# Altium schematic sheet Sheet1.SchDoc
size A2
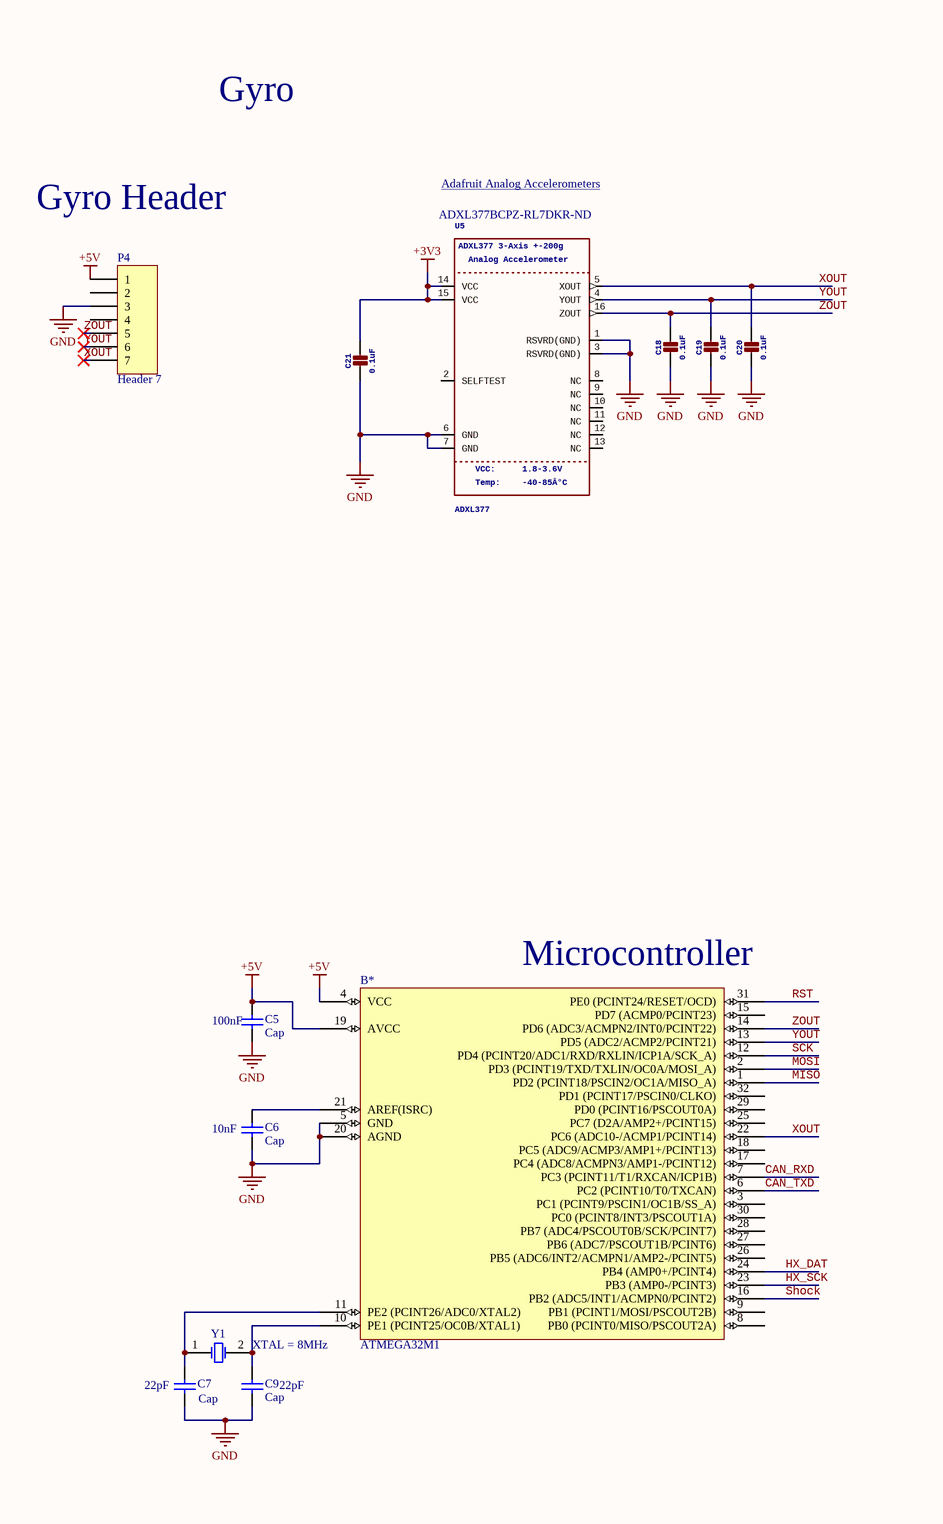
[diagram p0: Sheet1.SchDoc, left]
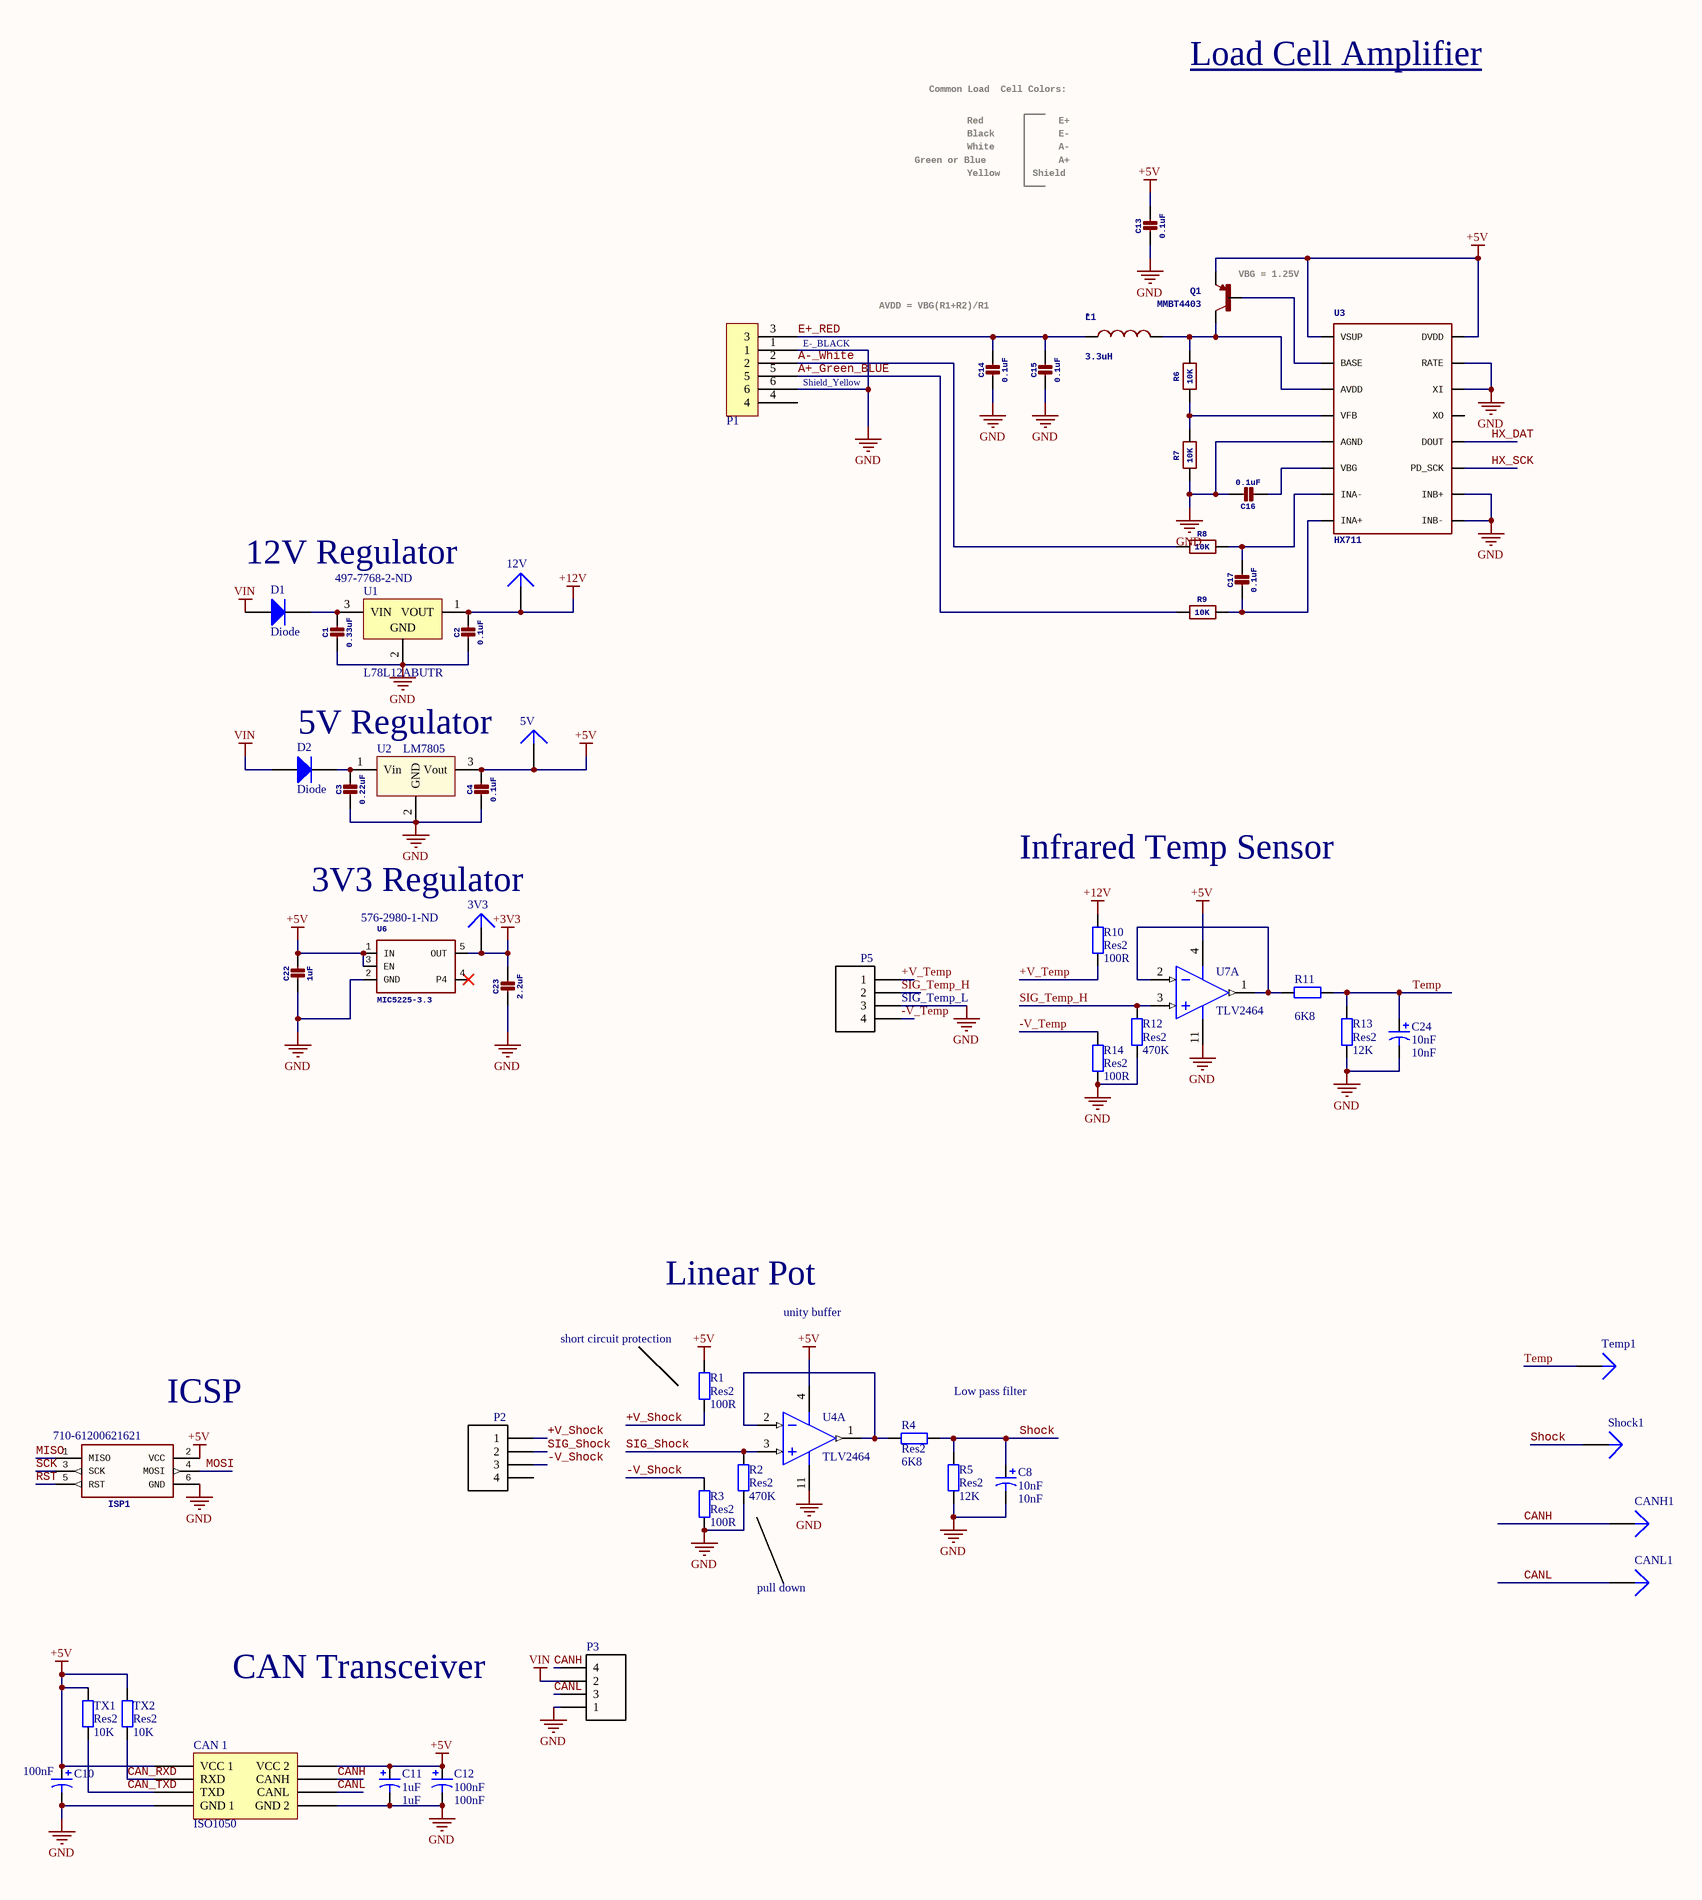
[diagram p1: Sheet1.SchDoc, right]

## Parts
3V3  TP  [SMD_TP]  (value not drawn)  (no BOM)
5V  TP  [SMD_TP]  (value not drawn)  (no BOM)
12V  TP  [SMD_TP]  (value not drawn)  (no BOM)
B*  ATMEGA32M1  [QFP80P900X900X120-32N]
C1  0.33uF  [6-0805_M]
C2  0.1uF  [6-0805_M]
C3  0.22uF  [6-0805_M]
C4  0.1uF  [6-0805_M]
C5  Cap  value 100nF  [CAP-0805]
C6  Cap  value 10nF  [CAP-0805]
C7  Cap  value 22pF  [CAP-0805]
C8  10nF  [6-0805_M]
C9  Cap  value 22pF  [CAP-0805]
C10  100nF  [6-0805_M]
C11  1uF  [6-0805_M]
C12  100nF  [6-0805_M]
C13  0.1uF  [6-0805_M]
C14  0.1uF  [6-0805_M]
C15  0.1uF  [6-0805_M]
C16  0.1uF  [6-0805_M]
C17  0.1uF  [6-0805_M]
C18  0.1uF  [0805_10MGAP]
C19  0.1uF  [0805_10MGAP]
C20  0.1uF  [0805_10MGAP]
C21  0.1uF  [0805_10MGAP]
C22  1uF  [6-0805_M]
C23  2.2uF  [6-0805_M]
C24  10nF  [6-0805_M]
CAN_1  ISO1050  [ISO1050]
CANH1  TP  [SMD_TP]  (value not drawn)  (no BOM)
CANL1  TP  [SMD_TP]  (value not drawn)  (no BOM)
D1  Diode  [6-0805_M]
D2  Diode  [6-0805_M]
ISP1  Supplier Part Number 1: 710-61200621621  [HDR2X3]  (hidden comment: AVRISP-BOX)
L1  3.3uH  [6-0805_M]
P1  S06B-PASK-2  [JST_S06B-PASK-2]  (value not drawn)
P2  S04B-PASK-2(LF)(SN)  [JST_S04B-PASK-2(LF)(SN)]  (value not drawn)
P3  S04B-PASK-2(LF)(SN)  [JST_S04B-PASK-2(LF)(SN)]  (value not drawn)
P4  Header 7  [HDR1X7]
P5  S04B-PASK-2(LF)(SN)  [JST_S04B-PASK-2(LF)(SN)]  (value not drawn)
Q1  MMBT4403  [SOT23-3]
R1  Res2  value 100R  [6-0805_M]
R2  Res2  value 470K  [6-0805_M]
R3  Res2  value 100R  [6-0805_M]
R4  Res2  value 6K8  [6-0805_M]
R5  Res2  value 12K  [6-0805_M]
R6  10K  [6-0805_M]
R7  10K  [6-0805_M]
R8  10K  [6-0805_M]
R9  10K  [6-0805_M]
R10  Res2  value 100R  [6-0805_M]
R11  value 6K8  [6-0805_M]
R12  Res2  value 470K  [6-0805_M]
R13  Res2  value 12K  [6-0805_M]
R14  Res2  value 100R  [6-0805_M]
Shock1  TP  [SMD_TP]  (value not drawn)  (no BOM)
Temp1  TP  [SMD_TP]  (value not drawn)  (no BOM)
TX1  Res2  value 10K  [6-0805_M]
TX2  Res2  value 10K  [6-0805_M]
U1  L78L12ABUTR  Supplier Part Number 1: 497-7768-2-ND  [SOT-89_M]
U2  LM7805  [SOT-223-2]
U3  HX711  [SO16]
U4  TLV2464  [SO14]  (part A of 4)
U5  ADXL377  ADXL3773-Axis+-200g: ADXL377 3-Axis +-200g  AnalogAccelerometer: Analog Accelerometer  VCC: VCC:  Temp: Temp:  Supplier Part Number 1: ADXL377BCPZ-RL7DKR-ND  [LFCSP16_LQ]
U6  MIC5225-3.3  Supplier Part Number 1: 576-2980-1-ND  [SOT95P280X145-5N]
U7  TLV2464  [SO14]  (part A of 4)
Y1  XTAL = 8MHz  [R38]

## Nets
+3V3: 3V3.1 C21.1 C23.1 U5.14(VCC) U5.15(VCC) U6.5(OUT)
+5V: 5V.1 B*.4(VCC) B*.19(AVCC) C4.1 C5.2 C10.1 C11.1 C12.1 C13.1 C22.1 CAN_1.1(VCC_1) CAN_1.8(VCC_2) ISP1.2(VCC) P4.1 Q1.2(E) R1.2 TX1.2 TX2.2 U2.3(Vout) U3.1(VSUP) U3.16(DVDD) U4.4(VCC) U6.1(IN) U6.3(EN) U7.4(VCC)
+12V: 12V.1 C2.1 R10.2 U1.1(VOUT)
GND: B*.5(GND) B*.20(AGND) C1.2 C2.2 C3.2 C4.2 C5.1 C6.1 C7.1 C8.2 C9.1 C10.2 C11.2 C12.2 C13.2 C14.2 C15.2 C16.1 C18.2 C19.2 C20.2 C21.2 C22.2 C23.2 C24.2 CAN_1.4(GND_1) CAN_1.5(GND_2) ISP1.6(GND) P1.1 P1.6 P3.1 P4.3 P5.3 R2.1 R3.1 R5.1 R7.1 R12.1 R13.1 R14.1 U1.2(GND) U2.2(GND) U3.5(AGND) U3.9(INB-) U3.10(INB+) U3.14(XI) U3.15(RATE) U4.11(VEE) U5.1(RSVRD(GND)) U5.3(RSVRD(GND)) U5.6(GND) U5.7(GND) U6.2(GND) U7.11(VEE)
VIN: D1.1(A) D2.1(A) P3.2
+V_Shock: P2.1 R1.1
+V_Temp: P5.1 R10.1
-V_Shock: P2.3 R3.2
-V_Temp: P5.4 R14.2
A+_Green_BLUE: P1.5 R9.1
A-_White: P1.2 R8.1
CAN_RXD: B*.7(PC3_(PCINT11/T1/RXCAN/ICP1B)) CAN_1.2(RXD) TX2.1
CAN_TXD: B*.6(PC2_(PCINT10/T0/TXCAN)) CAN_1.3(TXD) TX1.1
CANH: CAN_1.7(CANH) CANH1.1 P3.4
CANL: CAN_1.6(CANL) CANL1.1 P3.3
E+_RED: C14.1 C15.1 L1.1 P1.3
HX_DAT: B*.24(PB4_(AMP0+/PCINT4)) U3.12(DOUT)
HX_SCK: B*.23(PB3_(AMP0-/PCINT3)) U3.11(PD_SCK)
MISO: B*.1(PD2_(PCINT18/PSCIN2/OC1A/MISO_A)) ISP1.1(MISO)
MOSI: B*.2(PD3_(PCINT19/TXD/TXLIN/OC0A/MOSI_A)) ISP1.4(MOSI)
RST: B*.31(PE0_(PCINT24/RESET/OCD)) ISP1.5(RST)
SCK: B*.12(PD4_(PCINT20/ADC1/RXD/RXLIN/ICP1A/SCK_A)) ISP1.3(SCK)
Shock: B*.16(PB2_(ADC5/INT1/ACMPN0/PCINT2)) C8.1 R4.1 R5.2 Shock1.1
SIG_Shock: P2.2 R2.2 U4.3(1_IN+)
SIG_Temp_H: P5.2 R12.2 U7.3(1_IN+)
Temp: C24.1 R11.1 R13.2 Temp1.1
XOUT: B*.22(PC6_(ADC10-/ACMP1/PCINT14)) C20.1 P4.7 U5.5(XOUT)
YOUT: B*.13(PD5_(ADC2/ACMP2/PCINT21)) C19.1 P4.6 U5.4(YOUT)
ZOUT: B*.14(PD6_(ADC3/ACMPN2/INT0/PCINT22)) C18.1 P4.5 U5.16(ZOUT)
NetB*_10: B*.10(PE1_(PCINT25/OC0B/XTAL1)) C9.2 Y1.2(OSC2)
NetB*_11: B*.11(PE2_(PCINT26/ADC0/XTAL2)) C7.2 Y1.1(OSC1)
NetB*_21: B*.21(AREF(ISRC)) C6.2
NetC1_1: C1.1 D1.2(K) U1.3(VIN)
NetC3_1: C3.1 D2.2(K) U2.1(Vin)
NetC16_2: C16.2 U3.6(VBG)
NetC17_1: C17.1 R8.2 U3.7(INA-)
NetC17_2: C17.2 R9.2 U3.8(INA+)
NetL1_2: L1.2 Q1.3(C) R6.2 U3.3(AVDD)
NetQ1_1: Q1.1(B) U3.2(BASE)
NetR4_2: R4.2 U4.1(1_OUT) U4.2(1_IN-)
NetR6_1: R6.1 R7.2 U3.4(VFB)
NetR11_2: R11.2 U7.1(1_OUT) U7.2(1_IN-)

Not connected (* = marked no-connect by the designer): B* 3(PC1_(PCINT9/PSCIN1/OC1B/SS_A)) 8(PB0_(PCINT0/MISO/PSCOUT2A)) 9(PB1_(PCINT1/MOSI/PSCOUT2B)) 15(PD7_(ACMP0/PCINT23)) 17(PC4_(ADC8/ACMPN3/AMP1-/PCINT12)) 18(PC5_(ADC9/ACMP3/AMP1+/PCINT13)) 25(PC7_(D2A/AMP2+/PCINT15)) 26(PB5_(ADC6/INT2/ACMPN1/AMP2-/PCINT5)) 27(PB6_(ADC7/PSCOUT1B/PCINT6)) 28(PB7_(ADC4/PSCOUT0B/SCK/PCINT7)) 29(PD0_(PCINT16/PSCOUT0A)) 30(PC0_(PCINT8/INT3/PSCOUT1A)) 32(PD1_(PCINT17/PSCIN0/CLKO)); P1 4; P2 4; P4 2 4; U3 13(XO); U5 2(SELFTEST) 8(NC) 9(NC) 10(NC) 11(NC) 12(NC) 13(NC); U6 4(P4)*

## Notes on the sheet
- Common Load
  Cell Colors:
- Red
- E+
- Load Cell Amplifier <https://morf.lv/strain-gauge-based-weight-sensor-load-cell>
- Green or Blue
- Black
- White
- Yellow
- Shield
- E-
- A-
- A+
- AVDD = VBG(R1+R2)/R1
- (near Q1) VBG = 1.25V
- (near P1) E-_BLACK
- (near P1) Shield_Yellow
- Gyro
- Adafruit Analog Accelerometers <https://github.com/adafruit/Adafruit-Analog-Accelerometers-PCBs>
- 12V Regulator
- Gyro Header
- 5V Regulator
- (near 3V3) 3V3 Regulator
- Infrared Temp Sensor
- (near P5) SIG_Temp_L
- Linear Pot
- (near B*) Microcontroller
- (near R1) short circuit protection
- unity buffer
- (near ISP1) ICSP
- Low pass filter
- pull down
- CAN Transceiver

## Library data of the parts
3V3 5V 12V CANH1 CANL1 Shock1 Temp1 = Plug: Test Point; LatestRevisionDate: 17-Jul-2002; LatestRevisionNote: Re-released for DXP Platform.; Publisher: Altium Limited
C1-C4 C13-C17 C22 = CAP_CERAMIC0805-NOOUTLINE: Ceramic CapacitorsFor new designs, use the packages preceded by an '_' character since they are more reliable:The following footprints should be used on most boards:For extremely tight-pitch boards where space is at a premium, the following 'micro-pitch' footprints can be used (smaller pads, no silkscreen outline, etc.):; GateName_1: G$1; SymbolName_1: CAPACITOR; DeviceName: 0805-NOOUTLINE; LibraryName: microbuilder; DeviceSetName: CAP_CERAMIC
C5-C7 C9 = Cap: Capacitor; Published: 8-Jun-2000; LatestRevisionDate: 17-Jul-2002; LatestRevisionNote: Re-released for DXP Platform.; PackageReference: RAD-0.3; Publisher: Altium Limited; PackageDescription: Radial Cap, Thru-Hole; 2 Leads; 0.3 in Pin Spacing
C8 C10-C12 C24 = Cap Pol3: Polarized Capacitor (Surface Mount); Published: 8-Jun-2000; LatestRevisionDate: 29-May-2009; LatestRevisionNote: IPC-7351 Footprint Added.; PackageReference: C0805; Publisher: Altium Limited; PackageDescription: Chip Capacitor
  C8 C24: Value: 10nF
  C10 C12: Value: 100nF
  C11: Value: 1uF
C18-C21 = CAP_CERAMIC0805_10MGAP: Ceramic CapacitorsFor new designs, use the packages preceded by an '_' character since they are more reliable:The following footprints should be used on most boards:For extremely tight-pitch boards where space is at a premium, the following 'micro-pitch' footprints can be used (smaller pads, no silkscreen outline, etc.):; GateName_1: G$1; SymbolName_1: CAPACITOR; DeviceName: 0805_10MGAP; LibraryName: microbuilder; DeviceSetName: CAP_CERAMIC
C23 = CAP_CERAMIC0805-NOOUTLINE: X7R/X5R / Ceramic CapacitorsFor new designs, use the packages preceded by an '_' character since they are more reliable:The following footprints should be used on most boards:For extremely tight-pitch boards where space is at a premium, the following 'micro-pitch' footprints can be used (smaller pads, no silkscreen outline, etc.):; GateName_1: G$1; SymbolName_1: CAPACITOR; DeviceName: 0805-NOOUTLINE; LibraryName: microbuilder; DeviceSetName: CAP_CERAMIC
CAN_1 = ISO1050: ISO1050 Isolated Can Transceiver; Supplier 1: Farnell; Supplier Part Number 1: 1755712
D1 D2 = Diode: Default Diode; Published: 8-Jun-2000; LatestRevisionDate: 17-Jul-2002; LatestRevisionNote: Re-released for DXP Platform.; PackageVersion: Sep-1996; PackageReference: SMC; Publisher: Altium Limited; PackageDescription: DO-214-AB/SMC; 2 C-Bend Leads; Body 7.9 x 5.9 mm, inc. leads (LxW); Code_JEDEC: DO-214-AB
ISP1 = AVRISP-BOX: AVR ISP HEADERStandard 6 pin header for AVR programming; Manufacturer: Wurth Electronics; Manufacturer Part Number: 61200621621; GateName_1: G$1; SymbolName_1: AVRISP; DeviceName: -BOX; Number of Positions: 6; Gender: Male; Connector Type: Male Pin; Pitch: 0.1inch; LibraryName: adafruit; DeviceSetName: AVRISP; Supplier 1: Mouser; Stock 1: 708; Pricing 1: 1=0.82, 10=0.74, 50=0.62, 100=0.535, 1000=0.366, 10000=0.366 (USD); Mount: Through Hole; Contact Plating: Gold; Contact Material: Copper; Colour: Black; Number of Rows: 2; Packaging: Tray; Termination: Solder; Number of Contacts: 6; Row Spacing: 0.1inch; REACH SVHC: Unknown; ComponentLink1URL: https://datasheet.ciiva.com/28391/76595-28391937.pdf; ComponentLink1Description: https://datasheet.ciiva.com/28391/76595-28391937.pdf
L1 = INDUCTOR0805-IND: InductorsBasic Inductor/Choke - 0603 and 1206. Footprints are not proven and vary greatly between part numbers.INDUCTOR POWER 3.3UH 4.0A SMD0.197" L x 0.197" W x 0.177" H (5.00mm x 5.00mm x 4.50mm); GateName_1: G$1; PROD_ID: NDUC-13076; SymbolName_1: INDUCTOR; DeviceName: 0805-IND; LibraryName: SparkFun-Passives; DeviceSetName: INDUCTOR; NAME: *
P1 = JST-S06B-PASK-2: JST (JAPAN SOLDERLESS TERMINALS) - S06B-PASK-2 - HEADER, PA, 6WAY, SIDE, 2MM; Manufacturer_Name: JST (JAPAN SOLDERLESS TERMINALS); Manufacturer_Part_Number: S06B-PASK-2; RS Part Number: *; RS Price/Stock: *; Arrow Part Number: S06B-PASK-2; Arrow Price/Stock: *; Datasheet Link: https://www.google.at/url?sa=t&rct=j&q=&esrc=s&source=web&cd=4&cad=rja&uact=8&ved=0ahUKEwjPh4aswZ_QAhUCbRQKHeV_BDkQFggvMAM&url=http%3A%2F%2Fwww.jst-mfg.com%2Fproduct%2Fpdf%2Feng%2FePA-F.pdf&usg=AFQjCNHIjr6tw3q-UCZFm2uwsNkZVsuEmQ&sig2=Xvk6c_Ei4q2HSUHpQHCoT
P2 P3 P5 = JST-S04B-PASK-2(LF)(SN): PA Series 4 Position 2.0mm Through Hole Wire to Board Single Row Shrouded Header; MP: S04B-PASK-2_LF__SN_; MF: JST; Package: None; SnapEDA_Link: https://www.snapeda.com/parts/S04B-PASK-2%2528LF%2529%2528SN%2529/JST%2520Sales%2520America%2520Inc/view-part/?ref=snap; Availability: Good; Price: 0.28 USD; Value: *
P4 = Header 7: Header, 7-Pin; LatestRevisionDate: 17-Jul-2002; LatestRevisionNote: Re-released for DXP Platform.; Publisher: Altium Limited
Q1 = TRANSISTOR_PNPMMBT4403: Generic PNP BJT  Double check pinouts against datasheets- not all devices are the same!MMBT3906 - 40V 200mA SOT-23 (TRANS-08052)MMBT4403 - 40V 600mA SOT-23 (TRANS-09245); GateName_1: G$1; SymbolName_1: PNP; DeviceName: MMBT4403; LibraryName: SparkFun-DiscreteSemi; DeviceSetName: TRANSISTOR_PNP; PROD_ID: TRANS-09245
R1-R5 R10-R14 TX1 TX2 = Res2: Resistor; Published: 8-Jun-2000; LatestRevisionDate: 17-Jul-2002; LatestRevisionNote: Re-released for DXP Platform.; PackageReference: AXIAL-0.4; Publisher: Altium Limited; PackageDescription: Axial Device, Thru-Hole; 2 Leads; 0.4 in Pin Spacing
R6-R9 = RESISTOR0805_NOOUTLINE: ResistorsFor new designs, use the packages preceded by an '_' character since they are more reliable:The following footprints should be used on most boards:For extremely tight-pitch boards where space is at a premium, the following 'micro-pitch' footprints can be used (smaller pads, no silkscreen outline, etc.):; GateName_1: G$1; SymbolName_1: RESISTOR; DeviceName: 0805_NOOUTLINE; LibraryName: microbuilder; DeviceSetName: RESISTOR
U1 = L78L12ABUTR: Positive Voltage Regulator, 12V, 4-Pin SOT-89, Tape and Reel; Manufacturer: STMicroelectronics; Number of Outputs: 1; Max Input Voltage: 35V; Max Output Current: 100mA; Quiescent Current: 6.5mA; Output Type: Fixed; Dropout Voltage: 1.7V; Min Input Voltage: 14V; Power Supply Rejection Ratio (PSRR): 42dB; ComponentLink1Description: Manufacturer URL; ComponentLink2Description: Datasheet; DatasheetVersion: 1/02/2011; ComponentLink1URL: http://www.st.com; PackageVersion: 2011; PackageDescription: 3-Pin SOT-89 Package 1.5 mm Pitch, 4.1 mm Lead Span; ComponentLink2URL: http://www.st.com/internet/com/TECHNICAL_RESOURCES/TECHNICAL_LITERATURE/DATASHEET/CD00000446.pdf; PackageReference: SOT-89; PartNumber: L78L12ABUTR; Supplier 1: Digi-Key; Manufacturer Part Number: L78L12ABUTR; Stock 1: 15000; Mount: Surface Mount; Case/Package: SOT-89; Number of Pins: 3; Min Operating Temperature: -40°C; Max Operating Temperature: 125°C; Output Voltage: 12V; Polarity: Positive; Output Current: 100mA; Packaging: Tape and Reel; Package Quantity: 1; Nominal Output Voltage: 12V; Number of Regulators: 1; Min Output Voltage: 12V; Length: 4.6mm; Height: 1.6mm; Width: 2.6mm; Radiation Hardening: No; REACH SVHC: No SVHC; Lead Free: Lead Free
U2 = LM78XX: LM340, LM340A and LM7805 Family Wide VIN 1.5-A Fixed Voltage Regulators / The LM340 and LM7805 Family monolithic 3-terminal / positive voltage regulators employ internal currentlimiting, / thermal shutdown and safe-area / compensation, making them essentially indestructible.; Manufacturer: Texas Instruments; Manufacturer Part Number: LM7805MPNOPB; Quiescent Current: 8mA; Dropout Voltage: 2V; Supplier: Element 14; Supplier Code: 2078564; ComponentLink1Description: datasheet; ComponentLink1URL: http://www.ti.com/lit/ds/symlink/lm340.pdf; Supplier 1: Digi-Key; Stock 1: 1295; Pricing 1: 1=1.36, 10=1.215, 100=0.9476, 500=0.7828 (USD); Min Operating Temperature: 0°C; Max Operating Temperature: 125°C; Lead Free: Contains Lead; Supplier Part Number 1: 296-44517-6-ND
U3 = HX711HX711: GateName_1: U1; PROD_ID: IC-12445; SymbolName_1: HX711; DeviceName: HX711; LibraryName: Testing; DeviceSetName: HX711; ComponentLink1Description: Datasheet; ComponentLink1URL: https://www.mouser.com/ds/2/813/hx711_english-1022875.pdf
U4 U7 = LM324: Low Power Quad Operational Amplifier; Manufacturer Part Number: LF347BD; Manufacturer: Texas Instruments; Text Field1: pristel=Nsc\nsanopea\<parttype>.ckt; Slew Rate: 13 V/µs; Voltage - Supply, Single/Dual (±): 7 V ~ 36 V, ±3.5 V ~ 18 V; Current - Input Bias: 50pA; Voltage - Input Offset: 3000µV; Number of Circuits: 4; Gain Bandwidth Product: 3MHz; Amplifier Type: J-FET; Current - Supply: 8mA; Supplier 1: Digi-Key; Supplier Part Number 1: 296-7136-5-ND; Package / Case: 14-SOIC (3.9mm Width), 14-SOL; Supplier: Digi-Key; Current - Output / Channel: -; Packaging: Tube; RoHS: RoHS Compliant; Output Type: -; Operating Temperature: 0°C ~ 70°C; Category: Integrated Circuits (ICs); Supplier Part Number: 296-7136-5-ND
U5 = ACCEL_ADXL377: ADXL377 +/-200g 3-Axis Analog Accelerometer; Manufacturer: Analog Devices; Manufacturer Part Number: ADXL377BCPZ-RL7; GateName_1: G$1; Sensitivity: 6.5mV/g; Bandwidth: 0.5Hz; Nominal Supply Current: 300uA; Axis: X, Y, Z; Min Supply Voltage: 1.8V; Max Supply Voltage: 3.6V; -3db Bandwidth: 1.6kHz; SymbolName_1: ADXL377; LibraryName: microbuilder; DeviceSetName: ACCEL_ADXL377; 1.8-3.6V: 1.8-3.6V; -40-85Â°C: -40-85Â°C; Supplier 1: Digi-Key; Stock 1: 13329; Pricing 1: 1=11.47, 10=10.359, 100=8.576, 500=7.4679 (USD); Number of Pins: 16; Min Operating Temperature: -40°C; Max Operating Temperature: 85°C; Package Quantity: 1; Packaging: Tape and Reel; Output Type: Analog; Operating Supply Current: 300uA; Lead Free: Contains Lead; REACH SVHC: No SVHC; ComponentLink1URL: https://datasheet.ciiva.com/6483/adxl377-6483845.pdf; ComponentLink1Description: https://datasheet.ciiva.com/6483/adxl377-6483845.pdf; ComponentLink2URL: https://datasheet.ciiva.com/6483/adxl377-6483848.pdf; ComponentLink2Description: https://datasheet.ciiva.com/6483/adxl377-6483848.pdf; ComponentLink3URL: https://datasheet.ciiva.com/6951/1670806-6951736.pdf; ComponentLink3Description: https://datasheet.ciiva.com/6951/1670806-6951736.pdf; ComponentLink4URL: https://datasheet.ciiva.com/7622/1670806-7622120.pdf; ComponentLink4Description: https://datasheet.ciiva.com/7622/1670806-7622120.pdf; ComponentLink5URL: https://datasheet.ciiva.com/6483/adxl377-6483849.pdf; ComponentLink5Description: https://datasheet.ciiva.com/6483/adxl377-6483849.pdf
U6 = VREG_SOT23-5: SOT23-5 Fixed Voltage RegulatorsPartCurrent OutV OutV InV DropoutÎ¸JA (Â°C/W)TJ (Â°C)Digikey Part No.  ADP121  150mA  3.3V  3.4-5.5V  0.09V @ 150mA  --  --  ADP121-AUJZ33R7CT-ND  ADP121  150mA  3.0V  3.1-5.5V  0.09V @ 150mA  --  --  ADP121-AUJZ30R7CT-ND  ADP122     300mA  3.3V  3.4-5.5V  0.085V @ 300mA  --  --  ADP122AUJZ-3.3-R7CT-ND  ADP1712     300mA  3.3V  3.5-5.5V  0.17V @ 300mA  --  --  ADP1712AUJZ-3.3-R7TR-ND  AP7311 (Low Cost)  150mA  3.3V  3.5-6V  0.15V @ 150mA  --  --  AP7311-33WG-7DICT-ND  LD39015M18R  150mA  1.8V  1.9V-5.5V  0.08V @ 100mA  --  --  497-6977-1-ND  LP2985A-33DBVR  150mA  3.3V  3.3-16V  0.28V @ 150mA  206  150  296-18479-1-ND  MCP1824T-3302E/OT  300mA  3.3V  3.5V-6V  0.2V @ 300mA  --  --  MCP1824T-3302E/OTCT-ND  MIC5205-2.5YM5 TR  150mA  2.5V  2.7-16V  0.165V @ 150mA  --  --  576-1257-2-ND  MIC5205-3.0YM5 TR  150mA  3.0V  3.2V-16V  0.165V @ 150mA  --  --  576-1258-2-ND  MIC5205-3.3YM5 TR  150mA  3.3V  3.5V-16V  0.165V @ 150mA  --  --  576-1259-2-ND  TPS780330220  150mA  3.3V+2.2V  3.6-5.5V  250mV Max  --  --  296-23332-1-ND  TDA3663/N1,135  100mA  3.3V  3.5-45V  0.18V @ 50mA  --  --  568-5343-1-ND                                Max operating temp can be calculated using Î¸JA, TJ (max junction temperature), and power in watts.  Set the "Maximum Ambient Temperature" until it reaches TJ ("Max Junction Temperature"), which is the absolute limit for safe use of the regulator: Heat Sink Temperature CalculatorFor example, With 12V source into a 3.3V LP2985 and a 30mA load, we are dissipating (12V-3.3V) * 0.03A = 0.261W.  With a Î¸JA of 206 Â°C/W, a TJ of 150Â°C, and 261mW we can safely use the chip without a heat sink up to 75Â°C (=147.1Â°C Junction Temperature).; Manufacturer: Microchip Micrel; Manufacturer Part Number: MIC5225-3.3YM5TR; GateName_1: G$1; Dropout Voltage: 310mV; Max Input Voltage: 16V; Min Input Voltage: 2.3V; Number of Regulators: 1; Reference Voltage: 1.24V; Accuracy: 2%; SymbolName_1: VREG_SOT23-5; LibraryName: microbuilder; DeviceSetName: VREG_SOT23-5; Supplier 1: Digi-Key; Stock 1: 10162; Pricing 1: 1=0.4, 25=0.3296, 100=0.2987 (USD); Mount: Surface Mount; Case/Package: SOT-23-5; Number of Pins: 5; Min Operating Temperature: -40°C; Max Operating Temperature: 125°C; Output Voltage: 3.3V; Output Current: 150mA; Packaging: Tape and Reel; Nominal Output Voltage: 3.3V; Number of Outputs: 1; Package Quantity: 3000; Max Output Current: 150mA; Min Output Voltage: 3.3V; Output Type: Fixed; Length: 2.9mm; Height: 1.1mm; Width: 1.6mm; REACH SVHC: No SVHC; Lead Free: Lead Free; ComponentLink1URL: https://datasheet.ciiva.com/2042/mic5225-2042949.pdf; ComponentLink1Description: https://datasheet.ciiva.com/2042/mic5225-2042949.pdf; ComponentLink2URL: https://datasheet.ciiva.com/2042/mic5225-2042950.pdf; ComponentLink2Description: https://datasheet.ciiva.com/2042/mic5225-2042950.pdf; ComponentLink3URL: https://datasheet.ciiva.com/2042/mic5225-2042951.pdf; ComponentLink3Description: https://datasheet.ciiva.com/2042/mic5225-2042951.pdf; ComponentLink4URL: https://datasheet.ciiva.com/16217/mic5225-16217018.pdf; ComponentLink4Description: https://datasheet.ciiva.com/16217/mic5225-16217018.pdf
Y1 = XTAL: Crystal Oscillator; Published: 8-Jun-2000; LatestRevisionDate: 17-Jul-2002; LatestRevisionNote: Re-released for DXP Platform.; PackageReference: R38; Publisher: Altium Limited; PackageDescription: Crystal, Thru-Hole; 2 Leads; Body 3.1 x 8.2 mm (Dia.xH)